# EAGLE schematic main (EAGLE 9.5.2)
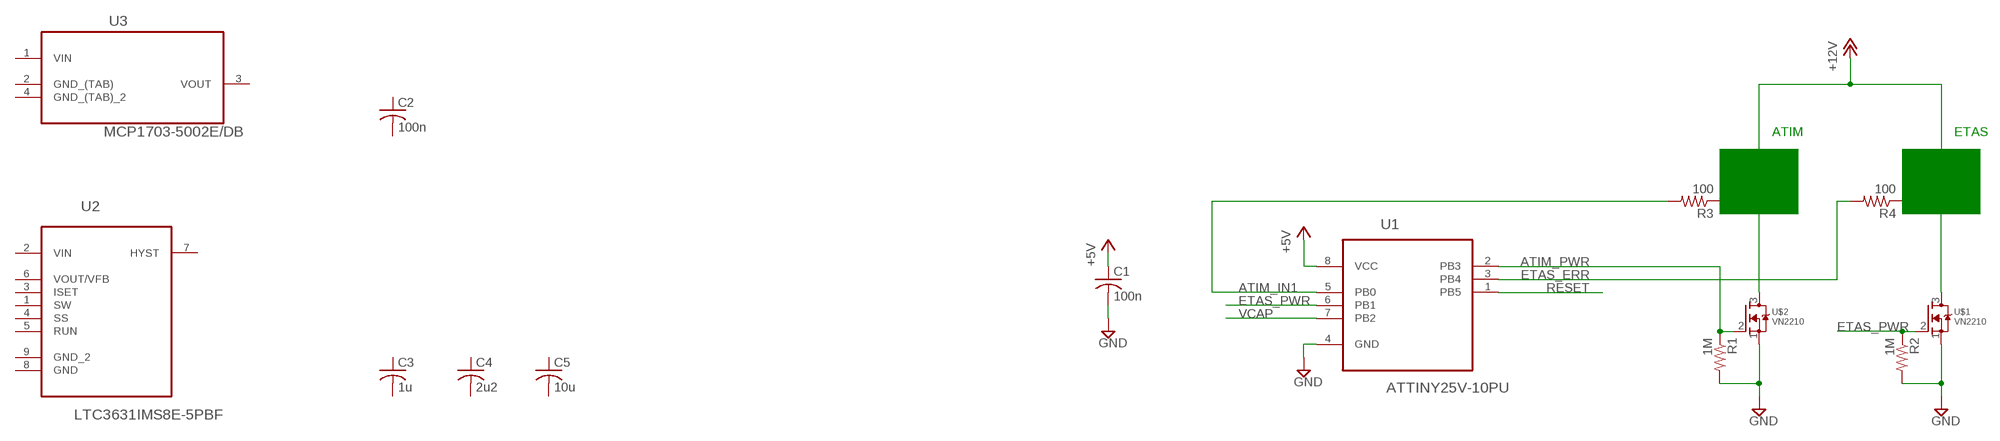
[diagram p0: schematic, sheet 1]

## Parts
C1  100n  C-USC0805  [C0805]
C2  100n  C-USC0805  [C0805]
C3  1u  C-USC0805  [C0805]
C4  2u2  C-USC0805  [C0805]
C5  10u  C-USC0805  [C0805]
R1  1M  R-US_M0805  [M0805]
R2  1M  R-US_M0805  [M0805]
R3  100  R-US_M0805  [M0805]
R4  100  R-US_M0805  [M0805]
U1  ATTINY25V-10PU  [DIP254P762X533-8]
U2  LTC3631IMS8E-5PBF  [SOP65P490X110-9N]
U3  MCP1703-5002E/DB  [SOT230P700X180-4N]
U$1  VN2210  [TO92]
U$2  VN2210  [TO92]

## Nets
+5V: C1.1 U1.8(VCC)
ATIM_IN1: R3.2 U1.5(PB0)
ATIM_PWR: R1.1 U1.2(PB3) U$2.2(G)
ETAS_ERR: R4.2 U1.3(PB4)
ETAS_PWR: R2.1 U1.6(PB1) U$1.2(G)
GND: C1.2 R1.2 R2.2 U1.4(GND) U$1.1(S) U$2.1(S)
N$1: U$2.3(D)
N$2: U$1.3(D)
RESET: U1.1(PB5)
VCAP: U1.7(PB2)
Unconnected: C2.1 C2.2 C3.1 C3.2 C4.1 C4.2 C5.1 C5.2 R3.1 R4.1 U2.1(SW) U2.3(ISET) U2.4(SS) U2.5(RUN) U2.6(VOUT/VFB) U2.7(HYST) U2.8(GND) U2.9(GND_2) U3.1(VIN) U3.2(GND_(TAB)) U3.3(VOUT) U3.4(GND_(TAB)_2)

## Notes on the sheet
- ATIM | ETAS

## Power pins joined to a net without a drawn wire
VIN: U2.2(VIN)

## Library data of the parts
C1-C5 = rcl:C-US: CAPACITOR, American symbol; SPICEPREFIX: C
R1-R4 = rcl:R-US_: RESISTOR, American symbol; SPICEPREFIX: R
U1 = Atmel_By_element14_Batch_1-00:ATTINY25V-10PU: 8-bit Microcontroller with 2/4/8KBytes In-System Programmable Flash; MPN: ATTINY25V-10PU; OC_FARNELL: 1455144; OC_NEWARK: 58M3780; PACKAGE: PDIP-8; SUPPLIER: Atmel
U2 = LTC_By_element14_Batch_1:LTC3631IMS8E-5PBF: Step-Down Converter; MPN: LTC3631IMS8E-5#PBF; OC_FARNELL: -; OC_NEWARK: 24R8685; PACKAGE: MSOP-8; SUPPLIER: Linear Technology
U3 = Microchip_By_element14_Batch_1:MCP1703-5002E/DB: IC, LDO REG, 250MA, 5V; MPN: MCP1703-5002E/DB; OC_FARNELL: 1627178; OC_NEWARK: 40M0624; PACKAGE: SOT-223-3; SUPPLIER: Microchip
U$1 U$2 = 7_segment_lib:VN2210